# Altium schematic sheet MosfetDriver.SchDoc
size A4
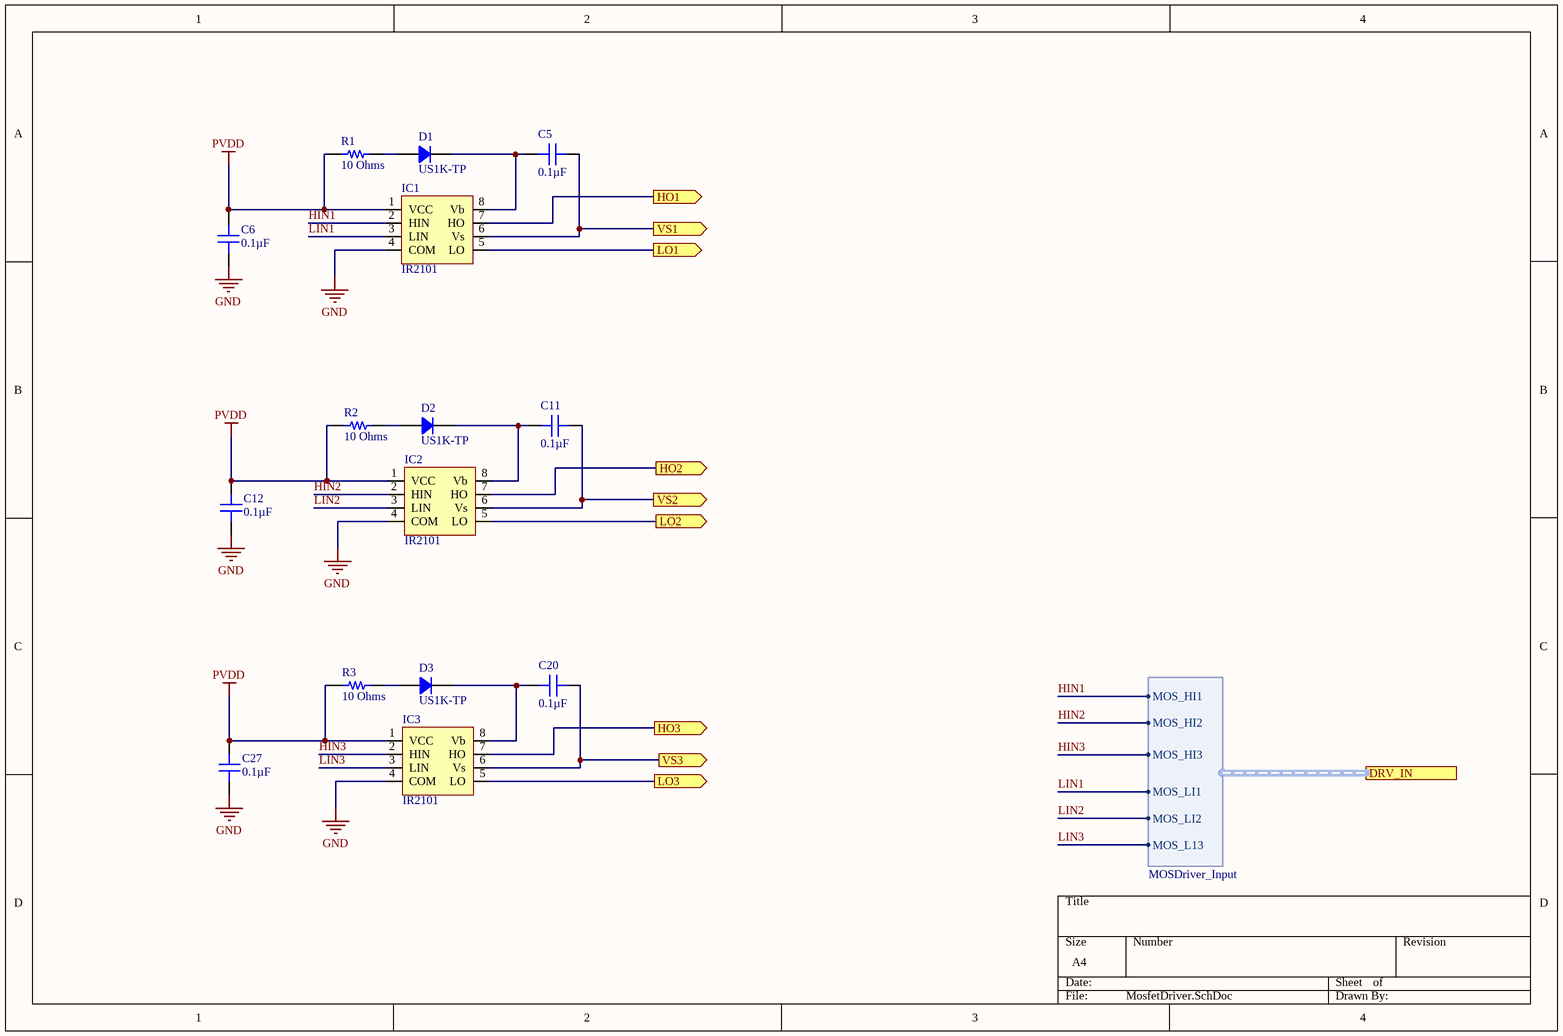
[diagram p0: MosfetDriver.SchDoc]

## Parts
C5  0.1µF  [CAP 0805_2012]
C6  0.1µF  [CAP 0805_2012]
C11  0.1µF  [CAP 0805_2012]
C12  0.1µF  [CAP 0805_2012]
C20  0.1µF  [CAP 0805_2012]
C27  0.1µF  [CAP 0805_2012]
D1  US1K-TP  [DO214AC SMA]
D2  US1K-TP  [DO214AC SMA]
D3  US1K-TP  [DO214AC SMA]
IC1  IR2101  [SOIC8]
IC2  IR2101  [SOIC8]
IC3  IR2101  [SOIC8]
R1  10 Ohms  [RES 0805_2012]
R2  10 Ohms  [RES 0805_2012]
R3  10 Ohms  [RES 0805_2012]

## Ports
DRV_IN (harness MOSDriver_Input), HO1 (out), HO2 (out), HO3 (out), LO1 (out), LO2 (out), LO3 (out), VS1 (out), VS2 (out), VS3 (out)

## Harnesses
MOSDriver_Input: MOS_HI1, MOS_HI2, MOS_HI3, MOS_LI1, MOS_LI2, MOS_L13

## Nets
GND: C6.1 C12.1 C27.1 IC1.4(COM) IC2.4(COM) IC3.4(COM)
PVDD: C6.2 C12.2 C27.2 IC1.1(VCC) IC2.1(VCC) IC3.1(VCC) R1.1 R2.1 R3.1
HIN1: IC1.2(HIN) ; port DRV_IN.MOS_HI1
HIN2: IC2.2(HIN) ; port DRV_IN.MOS_HI2
HIN3: IC3.2(HIN) ; port DRV_IN.MOS_HI3
HO1: IC1.7(HO) ; port HO1
HO2: IC2.7(HO) ; port HO2
HO3: IC3.7(HO) ; port HO3
LIN1: IC1.3(LIN) ; port DRV_IN.MOS_LI1
LIN2: IC2.3(LIN) ; port DRV_IN.MOS_LI2
LIN3: IC3.3(LIN) ; port DRV_IN.MOS_L13
LO1: IC1.5(LO) ; port LO1
LO2: IC2.5(LO) ; port LO2
LO3: IC3.5(LO) ; port LO3
VS1: C5.1 IC1.6(Vs) ; port VS1
VS2: C11.1 IC2.6(Vs) ; port VS2
VS3: C20.1 IC3.6(Vs) ; port VS3
NetC5_2: C5.2 D1.2 IC1.8(Vb)
NetC11_2: C11.2 D2.2 IC2.8(Vb)
NetC20_2: C20.2 D3.2 IC3.8(Vb)
NetD1_1: D1.1 R1.2
NetD2_1: D2.1 R2.2
NetD3_1: D3.1 R3.2

## Library data of the parts
C5 C6 C11 C12 C20 C27 = CML0805X7R104KT50V: CAP CER 0.1UF 50V X7R 0805; Manufacturer: Stackpole Electronics Inc; Tolerance: ±10%; Part Number: CML0805X7R104KT50V; Value: 0.1µF; Applications: General Purpose; Capacitance: 0.1µF; ComponentLink1Description: Datasheet; ComponentLink1URL: http://www.seielect.com/Catalog/SEI-CML.PDF; ComponentLink2Description: DigiKey Link; ComponentLink2URL: http://digikey.com/product-detail/en/stackpole-electronics-inc/CML0805X7R104KT50V/738-CML0805X7R104KT50VCT-ND/10660126; Device Package: 0805 (2012 Metric); LastUpdated: 2.9.2020 01:04:17; Lifecycle Status: Active; Minimum Order: 1; Mounting Type: Surface Mount, MLCC; Operating Temperature: -55°C ~ 125°C; Package / Case: 0805 (2012 Metric); Packaging: Unknown; PartId: 26478; Part Status: Active; Price: 0.02; Series: CML_X7R; Supplier 1: DigiKey; Supplier Part Number 1: 738-CML0805X7R104KT50VCT-ND; Temperature Coefficient: X7R; Voltage - Rated: 50V
D1-D3 = US1K-TP: DIODE GEN PURP 800V 1A DO214AC; Manufacturer: Micro Commercial Co; Capacitance @ Vr, F: 10pF @ 4V, 1MHz; Current - Reverse Leakage @ Vr: 10µA @ 800V; Diode Type: Standard; Reverse Recovery Time (trr): 75ns; Speed: Fast Recovery =< 500ns, > 200mA (Io); Voltage - Forward (Vf) (Max) @ If: 1.7V @ 1A; Part Number: US1K-TP; ComponentLink1Description: Datasheet; ComponentLink1URL: https://www.mccsemi.com/pdf/Products/US1A-US1M(DO-214AC).pdf; ComponentLink2Description: DigiKey Link; ComponentLink2URL: http://digikey.com/product-detail/en/micro-commercial-co/US1K-TP/US1K-TPMSCT-ND/1793442; Current - Average Rectified (Io): 1A; LastUpdated: 2.9.2020 01:19:02; Lifecycle Status: Active; Minimum Order: 1; Mounting Type: Surface Mount; Operating Temperature - Junction: -65°C ~ 175°C; Package / Case: DO-214AC, SMA; Packaging: TapeAndReel; PartId: 887; Part Status: Active; Price: 0.08; Series: -; Supplier 1: DigiKey; Supplier Part Number 1: US1K-TPMSCT-ND; Supplier Device Package: DO-214AC (SMA); Voltage - DC Reverse (Vr) (Max): 800V
IC1-IC3 = IR2101: IC-2101 HIGH-LOW DRIVER SOP8 IR
R1-R3 = RK73H2ATTD10R0F: RES 10 OHM 1% 1/4W 0805; Manufacturer: KOA Speer Electronics, Inc.; Power (Watts): 0.25W, 1/4W; Temperature Coefficient: ±100ppm/°C; Part Number: RK73H2ATTD10R0F; Value: 10 Ohms; ComponentLink1Description: Datasheet; ComponentLink1URL: http://www.koaspeer.com/catimages/Products/RK73H/RK73H.pdf; ComponentLink2Description: DigiKey Link; ComponentLink2URL: http://digikey.com/product-detail/en/koa-speer-electronics-inc/RK73H2ATTD10R0F/2019-RK73H2ATTD10R0FCT-ND/10234529; Composition: Thick Film; Device Package: 0805 (2012 Metric); Features: Automotive AEC-Q200, Moisture Resistant; Height - Seated (Max): 0.024" (0.60mm); LastUpdated: 2.9.2020 01:15:00; Lifecycle Status: Active; Minimum Order: 1; Number of Terminations: 2; Operating Temperature: -55°C ~ 155°C; Package / Case: 0805 (2012 Metric); Packaging: CutTape; PartId: 38358; Part Status: Active; Price: 0.10; Ratings: AEC-Q200; Resistance: 10 Ohms; Series: RK73H; Size / Dimension: 0.079" L x 0.049" W (2.00mm x 1.25mm); Supplier 1: DigiKey; Supplier Part Number 1: 2019-RK73H2ATTD10R0FCT-ND; Supplier Device Package: 0805; Tolerance: ±1%